# Altium project Node_PCB.PrjPcb
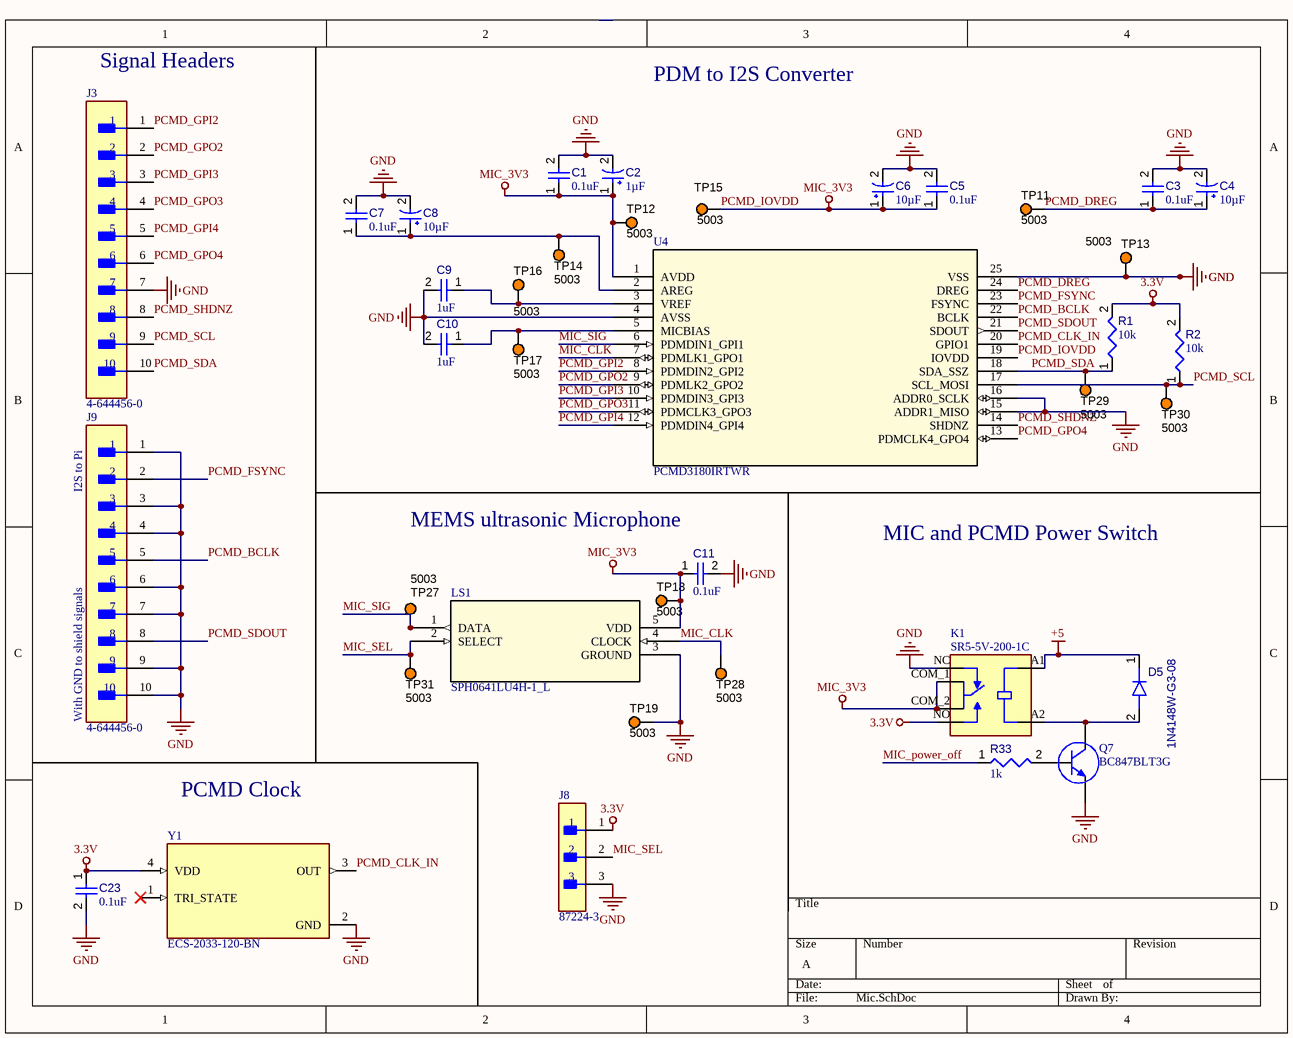
[diagram p0: Mic.SchDoc]
4 sheets, 164 parts. Net scope: global (net labels, ports and power ports of the same name join across sheets).
Board file: Node_Layout.PcbDoc
Sheets:
  Mic.SchDoc
  LoRa.SchDoc
  ATMEGA.SchDoc
  Power.SchDoc

## Sheet Mic.SchDoc
size A; SheetNumber: 1; SheetTotal: 4

### Parts
C1  value 0.1uF  [CAPC1608X90X40NL10T20]  (hidden comment: Capacitor 100 nF +/-10% 50 V 0603)
C2  value 1µF  [CAPPR55-200-1100X500X1200]  (hidden comment: ECA-1HHG010)
C3  value 0.1uF  [CAPC1608X90X40NL10T20]  (hidden comment: Capacitor 100 nF +/-10% 50 V 0603)
C4  value 10µF  [CAPPR55-200-1100X500X1200]  (hidden comment: ECA-1HHG010)
C5  value 0.1uF  [CAPC1608X90X40NL10T20]  (hidden comment: Capacitor 100 nF +/-10% 50 V 0603)
C6  value 10µF  [CAPPR55-200-1100X500X1200]  (hidden comment: ECA-1HHG010)
C7  value 0.1uF  [CAPC1608X90X40NL10T20]  (hidden comment: Capacitor 100 nF +/-10% 50 V 0603)
C8  value 10µF  [CAPPR55-200-1100X500X1200]  (hidden comment: ECA-1HHG010)
C9  value 1uF  [CAPC1608X90X40NL10T20]  (hidden comment: Capacitor 100 nF +/-10% 50 V 0603)
C10  value 1uF  [CAPC1608X90X40NL10T20]  (hidden comment: Capacitor 100 nF +/-10% 50 V 0603)
C11  value 0.1uF  [CAPC1608X90X40NL10T20]  (hidden comment: Capacitor 100 nF +/-10% 50 V 0603)
C23  value 0.1uF  [CAPC1608X90X40NL10T20]  (hidden comment: Capacitor 100 nF +/-10% 50 V 0603)
D5  1N4148W-G3-08  [FP-S8-V-3910_01-001-IPC_B]
J3  4-644456-0  [FP-4-644456-0-MFG]
J8  87224-3  [FP-87224-3-MFG]
J9  4-644456-0  [FP-4-644456-0-MFG]
K1  SR5-5V-200-1C  [RELAY_SR5-5V-200-1C]
LS1  SPH0641LU4H-1_L  [SPH0655LM4H-1_KNO_L]
Q7  BC847BLT3G  [ONSC-SOT-23-3-318-08_V]
R1  value 10k  [RESC0603(1608)_L]  (hidden comment: Resistor 120R +/-5 % 0603 0.1 W)
R2  value 10k  [RESC0603(1608)_L]  (hidden comment: Resistor 120R +/-5 % 0603 0.1 W)
R33  value 1k  [RESC0603(1608)_L]  (hidden comment: Resistor 120R +/-5 % 0603 0.1 W)
TP11  5003  [KSTN-5003]
TP12  5003  [KSTN-5003]
TP13  5003  [KSTN-5003]
TP14  5003  [KSTN-5003]
TP15  5003  [KSTN-5003]
TP16  5003  [KSTN-5003]
TP17  5003  [KSTN-5003]
TP18  5003  [KSTN-5003]
TP19  5003  [KSTN-5003]
TP27  5003  [KSTN-5003]
TP28  5003  [KSTN-5003]
TP29  5003  [KSTN-5003]
TP30  5003  [KSTN-5003]
TP31  5003  [KSTN-5003]
U4  PCMD3180IRTWR  [QFN_0IRTWR_TEX]
Y1  ECS-2033-120-BN  [OSC_ECS-2033-120-BN]

### Nets
3.3V: C23.1 J8.1 K1.NO R1.2 R2.2 Y1.4(VDD)
+5: D5.1(K) K1.A1(COIL1)
GND: C1.2 C2.2 C3.2 C4.2 C5.2 C6.2 C7.2 C8.2 C9.2 C10.2 C11.2 C23.2 J3.7 J8.3 J9.1 J9.3 J9.4 J9.6 J9.7 J9.9 J9.10 K1.NC LS1.3(GROUND) Q7.1(E) TP13.1 TP19.1 U4.4(AVSS) U4.15(ADDR1_MISO) U4.16(ADDR0_SCLK) U4.25(VSS) Y1.2(GND)  [project net Batt-]
PCMD_IOVDD: C1.1 C2.1 C5.1 C6.1 C11.1 K1.COM_1(COM1) K1.COM_2(COM2) LS1.5(VDD) TP12.1 TP15.1 TP18.1 U4.1(AVDD) U4.19(IOVDD)  [also labelled MIC_3V3]
MIC_CLK: LS1.4(CLOCK) TP28.1 U4.7(PDMLK1_GPO1)
MIC_power_off: R33.1
MIC_SEL: J8.2 LS1.2(SELECT) TP31.1
MIC_SIG: LS1.1(DATA) TP27.1 U4.6(PDMDIN1_GPI1)
PCMD_BCLK: J9.5 U4.22(BCLK)
PCMD_CLK_IN: U4.20(GPIO1) Y1.3(OUT)
PCMD_DREG: C3.1 C4.1 TP11.1 U4.24(DREG)
PCMD_FSYNC: J9.2 U4.23(FSYNC)
PCMD_GPI2: J3.1 U4.8(PDMDIN2_GPI2)
PCMD_GPI3: J3.3 U4.10(PDMDIN3_GPI3)
PCMD_GPI4: J3.5 U4.12(PDMDIN4_GPI4)
PCMD_GPO2: J3.2 U4.9(PDMLK2_GPO2)
PCMD_GPO3: J3.4 U4.11(PDMCLK3_GPO3)
PCMD_GPO4: J3.6 U4.13(PDMCLK4_GPO4)
PCMD_SCL: J3.9 R2.1 TP30.1 U4.17(SCL_MOSI)
PCMD_SDA: J3.10 R1.1 TP29.1 U4.18(SDA_SSZ)
PCMD_SDOUT: J9.8 U4.21(SDOUT)
PCMD_SHDNZ: J3.8 U4.14(SHDNZ)
NetC7_1: C7.1 C8.1 TP14.1 U4.2(AREG)
NetC9_1: C9.1 TP16.1 U4.3(VREF)
NetC10_1: C10.1 TP17.1 U4.5(MICBIAS)
NetD5_2: D5.2(A) K1.A2(COIL2) Q7.3(C)
NetQ7_2: Q7.2(B) R33.2

Not connected (* = marked no-connect by the designer): Y1 1(TRI_STATE)*

### Notes on the sheet
- Signal Headers
- PDM to I2S Converter
- (near J9) I2S to Pi
- (near C11) MEMS ultrasonic Microphone
- MIC and PCMD Power Switch
- (near J9) With GND to shield signals
- PCMD Clock

### Library data of the parts
C1 C3 C5 C7 C9-C11 C23 = CMP-001-00017-6: Chip Capacitor, 100 nF, +/- 10%, 50 V, 0603 (1608 Metric); Voltage Rating: 50V; Capacitor Type: Ceramic; Tolerance: 10%; Mounting Technology: SM; Max Operating Temperature: 125°C; RoHS Compliant: True; Pins: 2; Case/Package: 0603; Min Operating Temperature: -55°C
C2 C4 C6 C8 = CMP-001-00024-7: Aluminum Electrolytic Capacitor, 1 uF, +/- 20%, 50 V, -55 to 105 degC, 2-Pin THD, RoHS, Bulk; Manufacturer: Panasonic; Voltage Rating: 50V; Ripple Current: 10mA; Packaging: Bulk; Package Quantity: 200; Tolerance: 20%; Min Operating Temperature: -55°C; Diameter: 5mm; Capacitor Type: Electrolytic; Datasheet Version: Mar-05; Ripple Current (AC): 10mA; Manufacturer URL: http://www.panasonic.com/; Case/Package: Radial; Mounting Technology: TH; Pins: 2; Package Reference: CAPPR55-200-1100X500X1200; Package Description: 2-Pin Radial Lead, Dia 5 mm, Height 12 mm; RoHS Compliant: True; Max Operating Temperature: 105°C; Lead Pitch: 2mm; Datasheet URL: https://datasheet.ciiva.com/7275/94060-7275472.pdf
D5 = CMP-004-00034-1: Rectifier Diode, 1 Phase, 1 Element, 0.15A, 100V V(RRM), Silicon
J3 J9 = CMP-002-00072-1: Board Connector, 10 Contact(s), 1 Row(s), Male, Straight, 0.1 inch Pitch, Solder Terminal, Natural Insulator, Plug; Min Operating Temperature: -55°C; RoHS Compliant: Yes; Mounting Technology: Board; Max Operating Temperature: 105°C; Connector Type: BOARD CONNECTOR
J8 = CMP-002-00078-1: Board Connector, 3 Contact(s), 1 Row(s), Male, Straight, 0.1 inch Pitch, Solder Terminal, Black Insulator, Receptacle; Mounting Technology: Board; Max Operating Temperature: 105°C; RoHS Compliant: Yes; Connector Type: BOARD CONNECTOR; Min Operating Temperature: -65°C
K1 = CMP-029-000000-1: 15.6 x 10.6 x 11.8 mm, 5 V, 1 A, SPDT (1 Form C), Through Hole, Signal Relay; MF: CUI Devices; Pin Count: 6; Component Type: Standard; MP: SR5-5V-200-1C; Design Item ID: SR5-5V-200-1C; Package: None; CUI_purchase_URL: https://www.cuidevices.com/product/relays/signal-relays/sr5-5v-200-1c?utm_source=snapeda.com&utm_medium=referral&utm_campaign=snapedaBOM; Source: SR5-5V-200-1C.SchLib; SnapEDA_Link: https://www.snapeda.com/parts/SR5-5V-200-1C/CUI+Devices/view-part/?ref=snap; Value: *; Check_prices: https://www.snapeda.com/parts/SR5-5V-200-1C/CUI+Devices/view-part/?ref=eda
LS1 = CMP-00027-00004-1: No Description Available; Mfr_Name: Knowles; Source: SPH0641LU4H-1_L.SchLib; Copyright: Copyright (C) 2023 Ultra Librarian. All rights reserved.; Manufacturer_Part_Number: SPH0641LU4H-1; Design Item ID: SPH0641LU4H-1_L; Type: DEV; RefDes: RefDes
Q7 = CMP-013-00036-1: Small Signal Bipolar Transistor, 0.1A I(C), 45V V(BR)CEO, 1-Element, NPN, Silicon, TO-236; Frequency: 100MHz; RoHS Compliant: Yes; Max Operating Temperature: 150°C; Pins: 3
R1 R2 R33 = CMP-009-00176-3: Chip Resistor, 120 Ohms, +/-5 %, 0.1 W, -55 to 155 degC, 0603; Power: 100mW; Tolerance: 5%; Max Operating Temperature: 155°C; Pins: 2; Case/Package: 0603; Min Operating Temperature: -55°C
TP11-TP19 TP27-TP31 = CMP-002-00037-2: Test Point, Orange, Height 4.6 mm, Tail Length 3 mm, 1-Pin THD, RoHS; Manufacturer: Keystone; Colour: Orange; Packaging: Bulk; Package Description: 1-Pin Through Hole Device, Dia 2.54 mm; Pins: 1; Package Reference: 5003; Datasheet Version: Jun-15; Case/Package: 5003; Mounting Technology: TH; Connector Type: TestPoint; Diameter: 2.54mm; Contact Material: Bronze; Datasheet URL: http://keyelco.com/userAssets/file/M65p56.pdf; Manufacturer URL: http://www.keyelco.com/; Package Quantity: 10; Contact Plating: Tin; RoHS Compliant: True
U4 = CMP-011-000000-1: No Description Available; Mfr_Name: Texas Instruments; Source: PCMD3180IRTWR.SchLib; Design Item ID: PCMD3180IRTWR; Manufacturer_Part_Number: PCMD3180IRTWR; RefDes: RefDes; Type: DEV; Copyright: Copyright (C) 2023 Ultra Librarian. All rights reserved.
Y1 = CMP-023-000000-1: 12MHz XO (Standard) CMOS Oscillator 3.3V Enable/Disable 4-SMD, No Lead; MF: ECS Inc.; Source: ECS-2033-120-BN.SchLib; Availability: Good; Package: SMD-4 ECS International; SnapEDA_Link: https://www.snapeda.com/parts/ECS-2033-120-BN/ECS%20Inc./view-part/2724744/?ref=snap; Component Type: Standard; Value: *; Pin Count: 4; Arrow_Electronics-Purchase-URL: https://snapeda.com/shop?store=Arrow+Electronics&id=2724744; Design Item ID: ECS-2033-120-BN; Mouser-Purchase-URL: https://snapeda.com/shop?store=Mouser&id=2724744; Price: None; DigiKey-Purchase-URL: https://snapeda.com/shop?store=DigiKey&id=2724744; MP: ECS-2033-120-BN

## Sheet LoRa.SchDoc
size A; SheetNumber: 2; SheetTotal: 4
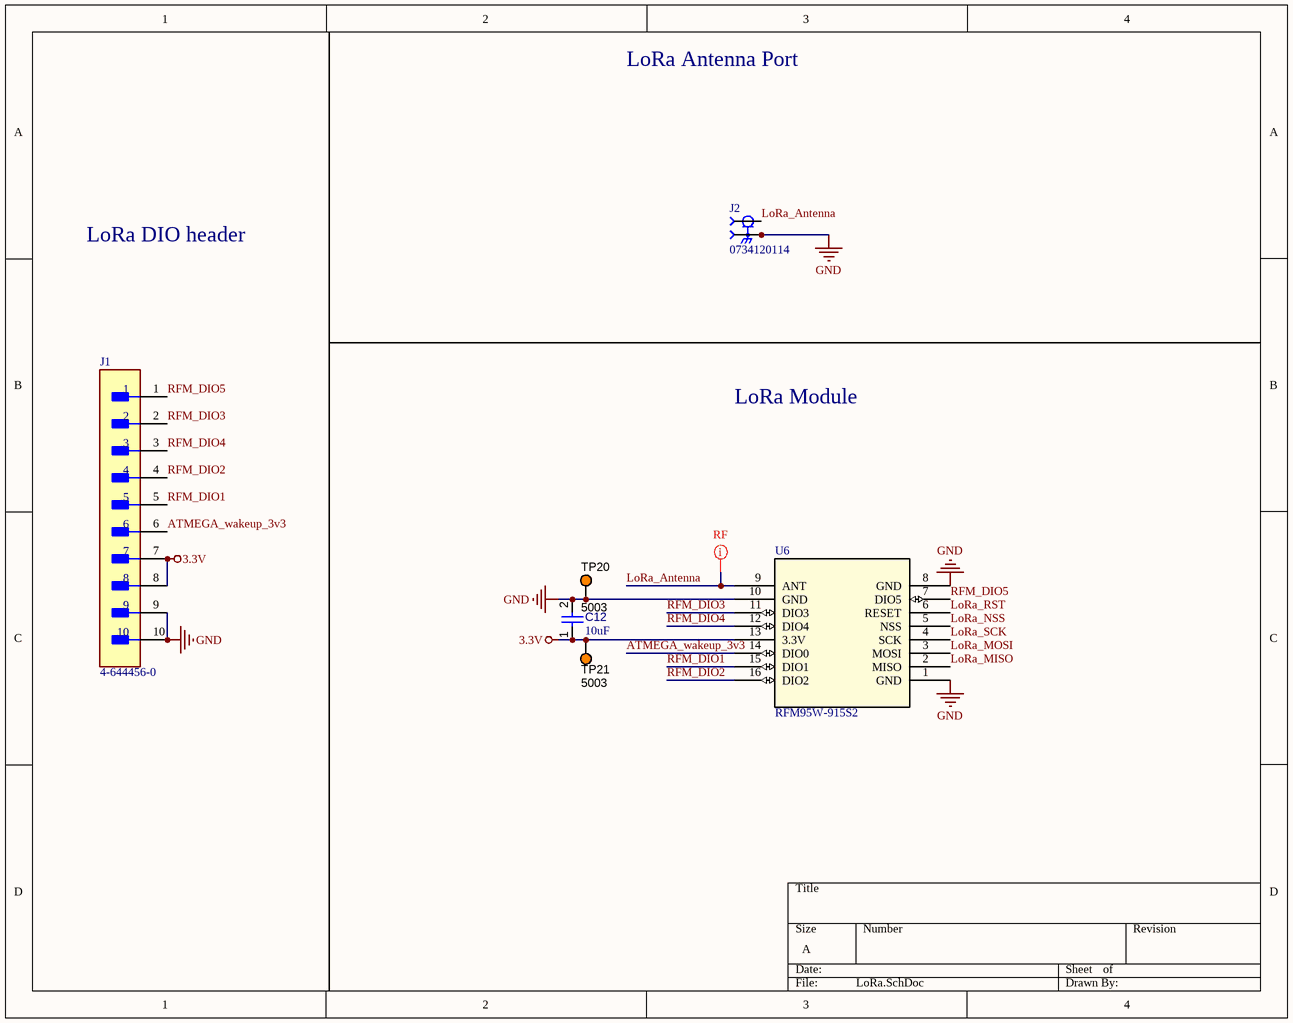
[diagram p1: LoRa.SchDoc]

### Parts
C12  value 10uF  [CAPC1608X90X40NL10T20]  (hidden comment: Capacitor 100 nF +/-10% 50 V 0603)
J1  4-644456-0  [FP-4-644456-0-MFG]
J2  0734120114  [MOLEX_0734120114]
TP20  5003  [KSTN-5003]
TP21  5003  [KSTN-5003]
U6  RFM95W-915S2  [IC16_RFM95W-915S2_RFS]

### Nets
3.3V: C12.1 J1.7 J1.8 TP21.1 U6.13(3.3V)
GND: C12.2 J1.9 J1.10 J2.2(GND) J2.3(GND) J2.4(GND) TP20.1 U6.1(GND) U6.8(GND) U6.10(GND)  [project net Batt-]
ATMEGA_wakeup_3v3: J1.6 U6.14(DIO0)
LoRa_Antenna: J2.1(SIG) U6.9(ANT)
LoRa_MISO: U6.2(MISO)
LoRa_MOSI: U6.3(MOSI)
LoRa_NSS: U6.5(NSS)
LoRa_RST: U6.6(RESET)
LoRa_SCK: U6.4(SCK)
RFM_DIO1: J1.5 U6.15(DIO1)
RFM_DIO2: J1.4 U6.16(DIO2)
RFM_DIO3: J1.2 U6.11(DIO3)
RFM_DIO4: J1.3 U6.12(DIO4)
RFM_DIO5: J1.1 U6.7(DIO5)

### Layout directives
net class RF: LoRa_Antenna

### Notes on the sheet
- LoRa Antenna Port
- LoRa DIO header
- LoRa Module

### Library data of the parts
C12 = CMP-001-00017-6: as C1 on sheet Mic; Tolerance: 10%; Mounting Technology: SM; Max Operating Temperature: 125°C; RoHS Compliant: True; Pins: 2; Case/Package: 0603; Min Operating Temperature: -55°C
J1 = CMP-002-00072-1: as J3 on sheet Mic; Min Operating Temperature: -55°C; RoHS Compliant: Yes; Mounting Technology: Board; Max Operating Temperature: 105°C; Connector Type: BOARD CONNECTOR
J2 = CMP-003-000000-1: U.FL (UMCC) Connector Receptacle, Male Pin 50Ohm Surface Mount Solder; MF: Molex; Value: *; Price: None; Source: 0734120114.SchLib; Component Type: Standard; Pin Count: 4; SnapEDA_Link: https://www.snapeda.com/parts/0734120114/Molex/view-part/557843/?ref=snap; Package: None; Availability: Unavailable; MP: 0734120114; Design Item ID: 0734120114
TP20 TP21 = CMP-002-00037-2: as TP11 on sheet Mic; Colour: Orange; Packaging: Bulk; Package Description: 1-Pin Through Hole Device, Dia 2.54 mm; Pins: 1; Package Reference: 5003; Datasheet Version: Jun-15; Case/Package: 5003; Mounting Technology: TH; Connector Type: TestPoint; Diameter: 2.54mm; Contact Material: Bronze; Datasheet URL: http://keyelco.com/userAssets/file/M65p56.pdf; Manufacturer URL: http://www.keyelco.com/; Package Quantity: 10; Contact Plating: Tin; RoHS Compliant: True
U6 = CMP-00025-00004-1: No Description Available; Mfr_Name: RF Solutions; Copyright: Copyright (C) 2023 Ultra Librarian. All rights reserved.; RefDes: RefDes; Source: RFM95W-915S2.SchLib; Type: DEV; Manufacturer_Part_Number: RFM95W-915S2; Design Item ID: RFM95W-915S2

## Sheet ATMEGA.SchDoc
size A; SheetNumber: 3; SheetTotal: 4
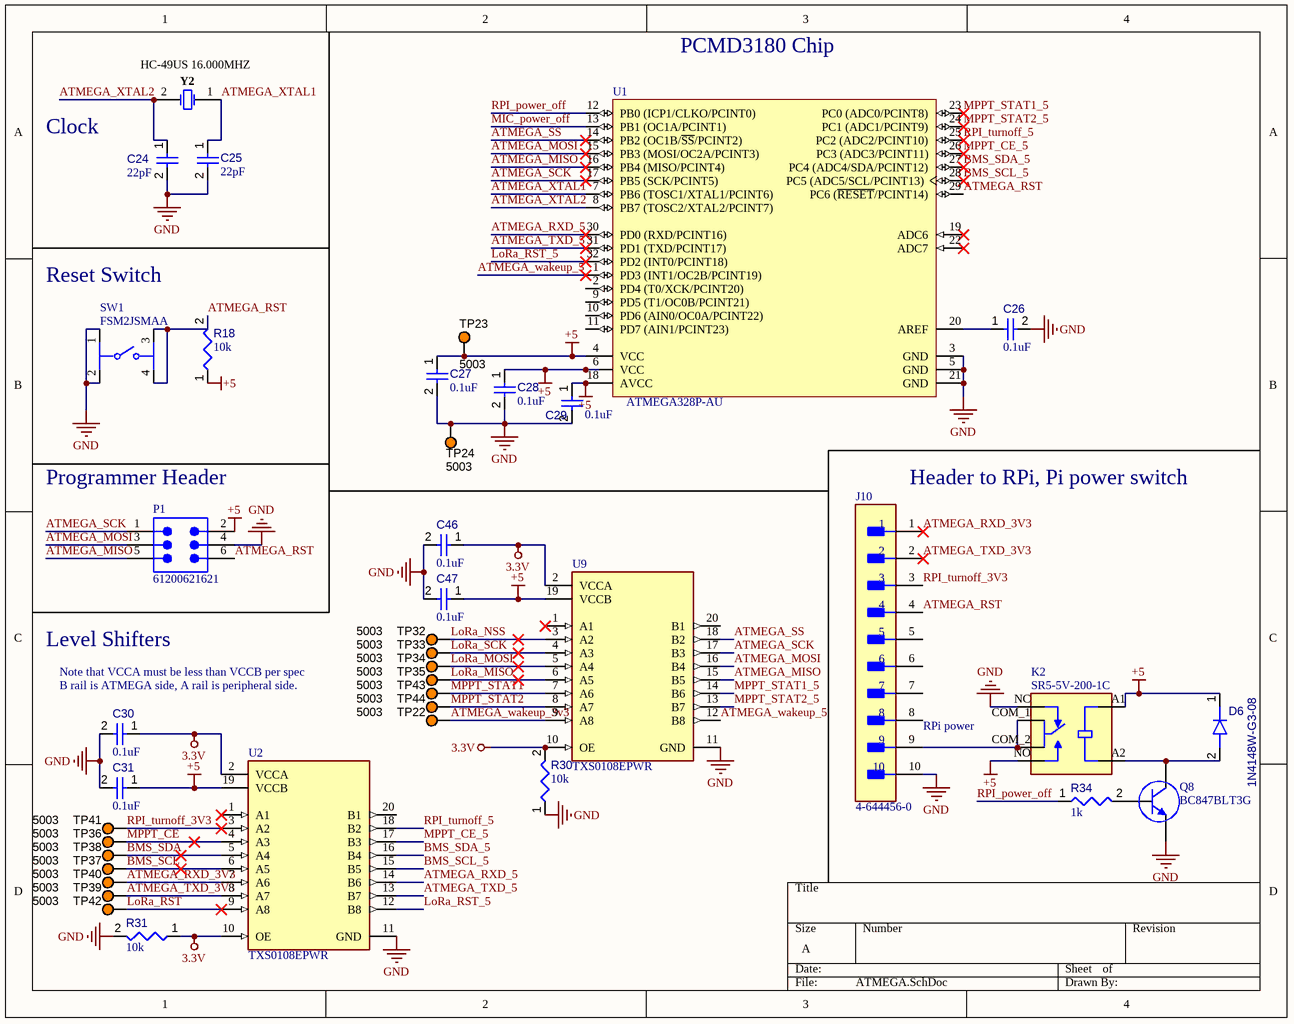
[diagram p2: ATMEGA.SchDoc]

### Parts
C24  value 22pF  [FP-C0603C-CF-IPC_B]  (hidden comment: C0603C220J5GACTU)
C25  value 22pF  [FP-C0603C-CF-IPC_B]  (hidden comment: C0603C220J5GACTU)
C26  value 0.1uF  [CAPC1608X90X40NL10T20]  (hidden comment: Capacitor 100 nF +/-10% 50 V 0603)
C27  value 0.1uF  [CAPC1608X90X40NL10T20]  (hidden comment: Capacitor 100 nF +/-10% 50 V 0603)
C28  value 0.1uF  [CAPC1608X90X40NL10T20]  (hidden comment: Capacitor 100 nF +/-10% 50 V 0603)
C29  value 0.1uF  [CAPC1608X90X40NL10T20]  (hidden comment: Capacitor 100 nF +/-10% 50 V 0603)
C30  value 0.1uF  [CAPC1608X90X40NL10T20]  (hidden comment: Capacitor 100 nF +/-10% 50 V 0603)
C31  value 0.1uF  [CAPC1608X90X40NL10T20]  (hidden comment: Capacitor 100 nF +/-10% 50 V 0603)
C46  value 0.1uF  [CAPC1608X90X40NL10T20]  (hidden comment: Capacitor 100 nF +/-10% 50 V 0603)
C47  value 0.1uF  [CAPC1608X90X40NL10T20]  (hidden comment: Capacitor 100 nF +/-10% 50 V 0603)
D6  1N4148W-G3-08  [FP-S8-V-3910_01-001-IPC_B]
J10  4-644456-0  [FP-4-644456-0-MFG]
K2  SR5-5V-200-1C  [RELAY_SR5-5V-200-1C]
P1  61200621621  [61200621621]
Q8  BC847BLT3G  [ONSC-SOT-23-3-318-08_V]
R18  value 10k  [RESC0603(1608)_L]  (hidden comment: Resistor 120R +/-5 % 0603 0.1 W)
R30  value 10k  [RESC0603(1608)_L]  (hidden comment: Resistor 120R +/-5 % 0603 0.1 W)
R31  value 10k  [RESC0603(1608)_L]  (hidden comment: Resistor 120R +/-5 % 0603 0.1 W)
R34  value 1k  [RESC0603(1608)_L]  (hidden comment: Resistor 120R +/-5 % 0603 0.1 W)
SW1  FSM2JSMAA  [FP-FSM2JSMAA-MFG]
TP22  5003  [KSTN-5003]
TP23  5003  [KSTN-5003]
TP24  5003  [KSTN-5003]
TP32  5003  [KSTN-5003]
TP33  5003  [KSTN-5003]
TP34  5003  [KSTN-5003]
TP35  5003  [KSTN-5003]
TP36  5003  [KSTN-5003]
TP37  5003  [KSTN-5003]
TP38  5003  [KSTN-5003]
TP39  5003  [KSTN-5003]
TP40  5003  [KSTN-5003]
TP41  5003  [KSTN-5003]
TP42  5003  [KSTN-5003]
TP43  5003  [KSTN-5003]
TP44  5003  [KSTN-5003]
U1  ATMEGA328P-AU  [ATML-32A_M]
U2  TXS0108EPWR  [FP-PW0020A-IPC_A]
U9  TXS0108EPWR  [FP-PW0020A-IPC_A]
Y2  HC-49US 16.000MHZ  [JPY-HC-49US]

### Nets
3.3V: C30.1 C46.1 R30.2 R31.1 U2.2(VCCA) U2.10(OE) U9.2(VCCA) U9.10(OE)
+5: C27.1 C28.1 C29.1 C31.1 C47.1 D6.1(K) K2.A1(COIL1) K2.NO P1.2 R18.1 TP23.1 U1.4(VCC) U1.6(VCC) U1.18(AVCC) U2.19(VCCB) U9.19(VCCB)
GND: C24.2 C25.2 C26.2 C27.2 C28.2 C29.2 C30.2 C31.2 C46.2 C47.2 J10.10 K2.NC P1.4 Q8.1(E) R30.1 R31.2 SW1.1 SW1.2 TP24.1 U1.3(GND) U1.5(GND) U1.21(GND) U2.11(GND) U9.11(GND)  [project net Batt-]
ATMEGA_MISO: P1.5 U1.16(PB4_(MISO/PCINT4)) U9.15(B5)
ATMEGA_MOSI: P1.3 U1.15(PB3_(MOSI/OC2A/PCINT3)) U9.16(B4)
ATMEGA_RST: J10.4 P1.6 R18.2 SW1.3 SW1.4 U1.29(PC6_(~{RESET}/PCINT14))
ATMEGA_RXD_3V3: J10.1 TP40.1 U2.7(A6)
ATMEGA_RXD_5: U1.30(PD0_(RXD/PCINT16)) U2.14(B6)
ATMEGA_SCK: P1.1 U1.17(PB5_(SCK/PCINT5)) U9.17(B3)
ATMEGA_SS: U1.14(PB2_(OC1B/~{SS}/PCINT2)) U9.18(B2)
ATMEGA_TXD_3V3: J10.2 TP39.1 U2.8(A7)
ATMEGA_TXD_5: U1.31(PD1_(TXD/PCINT17)) U2.13(B7)
ATMEGA_wakeup_3v3: TP22.1 U9.9(A8)
ATMEGA_wakeup_5: U1.1(PD3_(INT1/OC2B/PCINT19)) U9.12(B8)
ATMEGA_XTAL1: C25.1 U1.7(PB6_(TOSC1/XTAL1/PCINT6)) Y2.1
ATMEGA_XTAL2: C24.1 U1.8(PB7_(TOSC2/XTAL2/PCINT7)) Y2.2
BMS_SCL: TP37.1 U2.6(A5)
BMS_SCL_5: U1.28(PC5_(ADC5/SCL/PCINT13)) U2.15(B5)
BMS_SDA: TP38.1 U2.5(A4)
BMS_SDA_5: U1.27(PC4_(ADC4/SDA/PCINT12)) U2.16(B4)
LoRa_MISO: TP35.1 U9.6(A5)
LoRa_MOSI: TP34.1 U9.5(A4)
LoRa_NSS: TP32.1 U9.3(A2)
LoRa_RST: TP42.1 U2.9(A8)
LoRa_RST_5: U1.32(PD2_(INT0/PCINT18)) U2.12(B8)
LoRa_SCK: TP33.1 U9.4(A3)
MIC_power_off: U1.13(PB1_(OC1A/PCINT1))
MPPT_CE: TP36.1 U2.4(A3)
MPPT_CE_5: U1.26(PC3_(ADC3/PCINT11)) U2.17(B3)
MPPT_STAT1: TP43.1 U9.7(A6)
MPPT_STAT1_5: U1.23(PC0_(ADC0/PCINT8)) U9.14(B6)
MPPT_STAT2: TP44.1 U9.8(A7)
MPPT_STAT2_5: U1.24(PC1_(ADC1/PCINT9)) U9.13(B7)
RPI_power_off: R34.1 U1.12(PB0_(ICP1/CLKO/PCINT0))
RPI_turnoff_3V3: J10.3 TP41.1 U2.3(A2)
RPI_turnoff_5: U1.25(PC2_(ADC2/PCINT10)) U2.18(B2)
NetC26_1: C26.1 U1.20(AREF)
NetD6_2: D6.2(A) K2.A2(COIL2) Q8.3(C)
NetJ10_9: J10.9 K2.COM_1(COM1) K2.COM_2(COM2)
NetQ8_2: Q8.2(B) R34.2

Not connected (* = marked no-connect by the designer): J10 5 6 7 8; U1 2(PD4_(T0/XCK/PCINT20)) 9(PD5_(T1/OC0B/PCINT21)) 10(PD6_(AIN0/OC0A/PCINT22)) 11(PD7_(AIN1/PCINT23)) 19(ADC6)* 22(ADC7)*; U2 1(A1)* 20(B1); U9 1(A1)* 20(B1)

### Notes on the sheet
- PCMD3180 Chip
- Clock
- Reset Switch
- (near P1) Programmer Header
- (near J10) Header to RPi, Pi power switch
- Level Shifters
- Note that VCCA must be less than VCCB per spec
- (near C30) B rail is ATMEGA side, A rail is peripheral side.
- (near J10) RPi power

### Library data of the parts
C24 C25 = CMP-001-00083-1: Ceramic Capacitor, Multilayer, Ceramic, 50V, 5% +Tol, 5% -Tol, C0G, 30ppm/Cel TC, 0.000022uF, Surface Mount, 0603; Mounting Technology: Surface Mount; Pins: 2; Max Operating Temperature: 125°C; Capacitor Type: Ceramic; RoHS Compliant: Yes; Min Operating Temperature: -55°C; Case/Package: 0603
C26-C31 C46 C47 = CMP-001-00017-6: as C1 on sheet Mic; Tolerance: 10%; Mounting Technology: SM; Max Operating Temperature: 125°C; RoHS Compliant: True; Pins: 2; Case/Package: 0603; Min Operating Temperature: -55°C
D6 = CMP-004-00034-1: as D5 on sheet Mic
J10 = CMP-002-00072-1: as J3 on sheet Mic; Min Operating Temperature: -55°C; RoHS Compliant: Yes; Mounting Technology: Board; Max Operating Temperature: 105°C; Connector Type: BOARD CONNECTOR
K2 = CMP-029-000000-1: as K1 on sheet Mic; Pin Count: 6; Component Type: Standard; MP: SR5-5V-200-1C; Design Item ID: SR5-5V-200-1C; Package: None; CUI_purchase_URL: https://www.cuidevices.com/product/relays/signal-relays/sr5-5v-200-1c?utm_source=snapeda.com&utm_medium=referral&utm_campaign=snapedaBOM; Source: SR5-5V-200-1C.SchLib; SnapEDA_Link: https://www.snapeda.com/parts/SR5-5V-200-1C/CUI+Devices/view-part/?ref=snap; Value: *; Check_prices: https://www.snapeda.com/parts/SR5-5V-200-1C/CUI+Devices/view-part/?ref=eda
P1 = CMP-002-00075-1: Board Connector, 6 Contact(s), 2 Row(s), Male, Straight, Solder Terminal; RoHS Compliant: Yes; Connector Type: BOARD CONNECTOR; Mounting Technology: Board
Q8 = CMP-013-00036-1: as Q7 on sheet Mic; RoHS Compliant: Yes; Max Operating Temperature: 150°C; Pins: 3
R18 R30 R31 R34 = CMP-009-00176-3: as R1 on sheet Mic; Max Operating Temperature: 155°C; Pins: 2; Case/Package: 0603; Min Operating Temperature: -55°C
SW1 = CMP-011-00013-1: Keypad Switch, 1 Switches, SPST, Momentary-tactile, 0.05A, 24VDC, 3.04N, Solder Terminal, Surface Mount-straight; RoHS Compliant: Yes; Max Operating Temperature: 85°C; Mounting Technology: Surface Mount; Min Operating Temperature: -20°C
TP22-TP24 TP32-TP44 = CMP-002-00037-2: as TP11 on sheet Mic; Colour: Orange; Packaging: Bulk; Package Description: 1-Pin Through Hole Device, Dia 2.54 mm; Pins: 1; Package Reference: 5003; Datasheet Version: Jun-15; Case/Package: 5003; Mounting Technology: TH; Connector Type: TestPoint; Diameter: 2.54mm; Contact Material: Bronze; Datasheet URL: http://keyelco.com/userAssets/file/M65p56.pdf; Manufacturer URL: http://www.keyelco.com/; Package Quantity: 10; Contact Plating: Tin; RoHS Compliant: True
U1 = CMP-020-00003-3: 8-Bit Microcontroller with 32 KBytes In-System Programmable Flash, 23 I/Os, -40 to 85 degC, 32-Pin TQFP (32A), RoHS, Tray; Manufacturer: Atmel; PWM Channels: 6; Frequency: 20MHz; RAM Size: 2KB; ADC Channels: 8; Max Supply Voltage: 5.5V; Density: 32KB; USB Channels: 0; I/Os: 23; Min Supply Voltage: 1.8V; Interface: USART; Package Reference: 32A; Package Description: 32-Pin Thin Profile Plastic Quad Flat Package, Body 7 x 7 mm, Pitch 0.8 mm; Max Operating Temperature: 85°C; Mounting Technology: SM; Datasheet URL: http://www.atmel.com/images/Atmel-8271-8-bit-AVR-Microcontroller-ATmega48A-48PA-88A-88PA-168A-168PA-328-328P_datasheet_Complete.pdf; Pins: 32; Packaging: Tray; RoHS Compliant: True; Max Clock Frequency: 20MHz; Ethernet Channels: 0; Clock Frequency: 20MHz; Case/Package: TQFP; Manufacturer URL: http://www.atmel.com/; Datasheet Version: Rev. 8271J, 11/2015; Package Quantity: 250; Min Operating Temperature: -40°C
U2 U9 = CMP-019-00054-1: Interface Circuit, PDSO20; Max Supply Voltage: 3.6V; Min Supply Voltage: 1.2V; Min Operating Temperature: -40°C; Case/Package: TSSOP; Max Operating Temperature: 85°C; RoHS Compliant: Yes; Pins: 20
Y2 = CMP-003-00005-2: Crystal, 16 MHz, +/- 30 ppm, 18 pF, -20 to 70 degC, 2-Pin THD; Manufacturer: Jing peng yuan; Frequency: 16MHz; Package Reference: HC-49US; Case/Package: HC-49US; RoHS Compliant: Unknown; Mounting Technology: TH; Package Description: 2-Pin Throug Hole Device, Body 11.05 x 4.65 mm, Pitch 4.9 mm; Datasheet URL: https://statics3.seeedstudio.com/images/opl/datasheet/306010014.pdf; Datasheet Version: May-15

## Sheet Power.SchDoc
size 431 x 279 mm; SheetNumber: 4; SheetTotal: 4
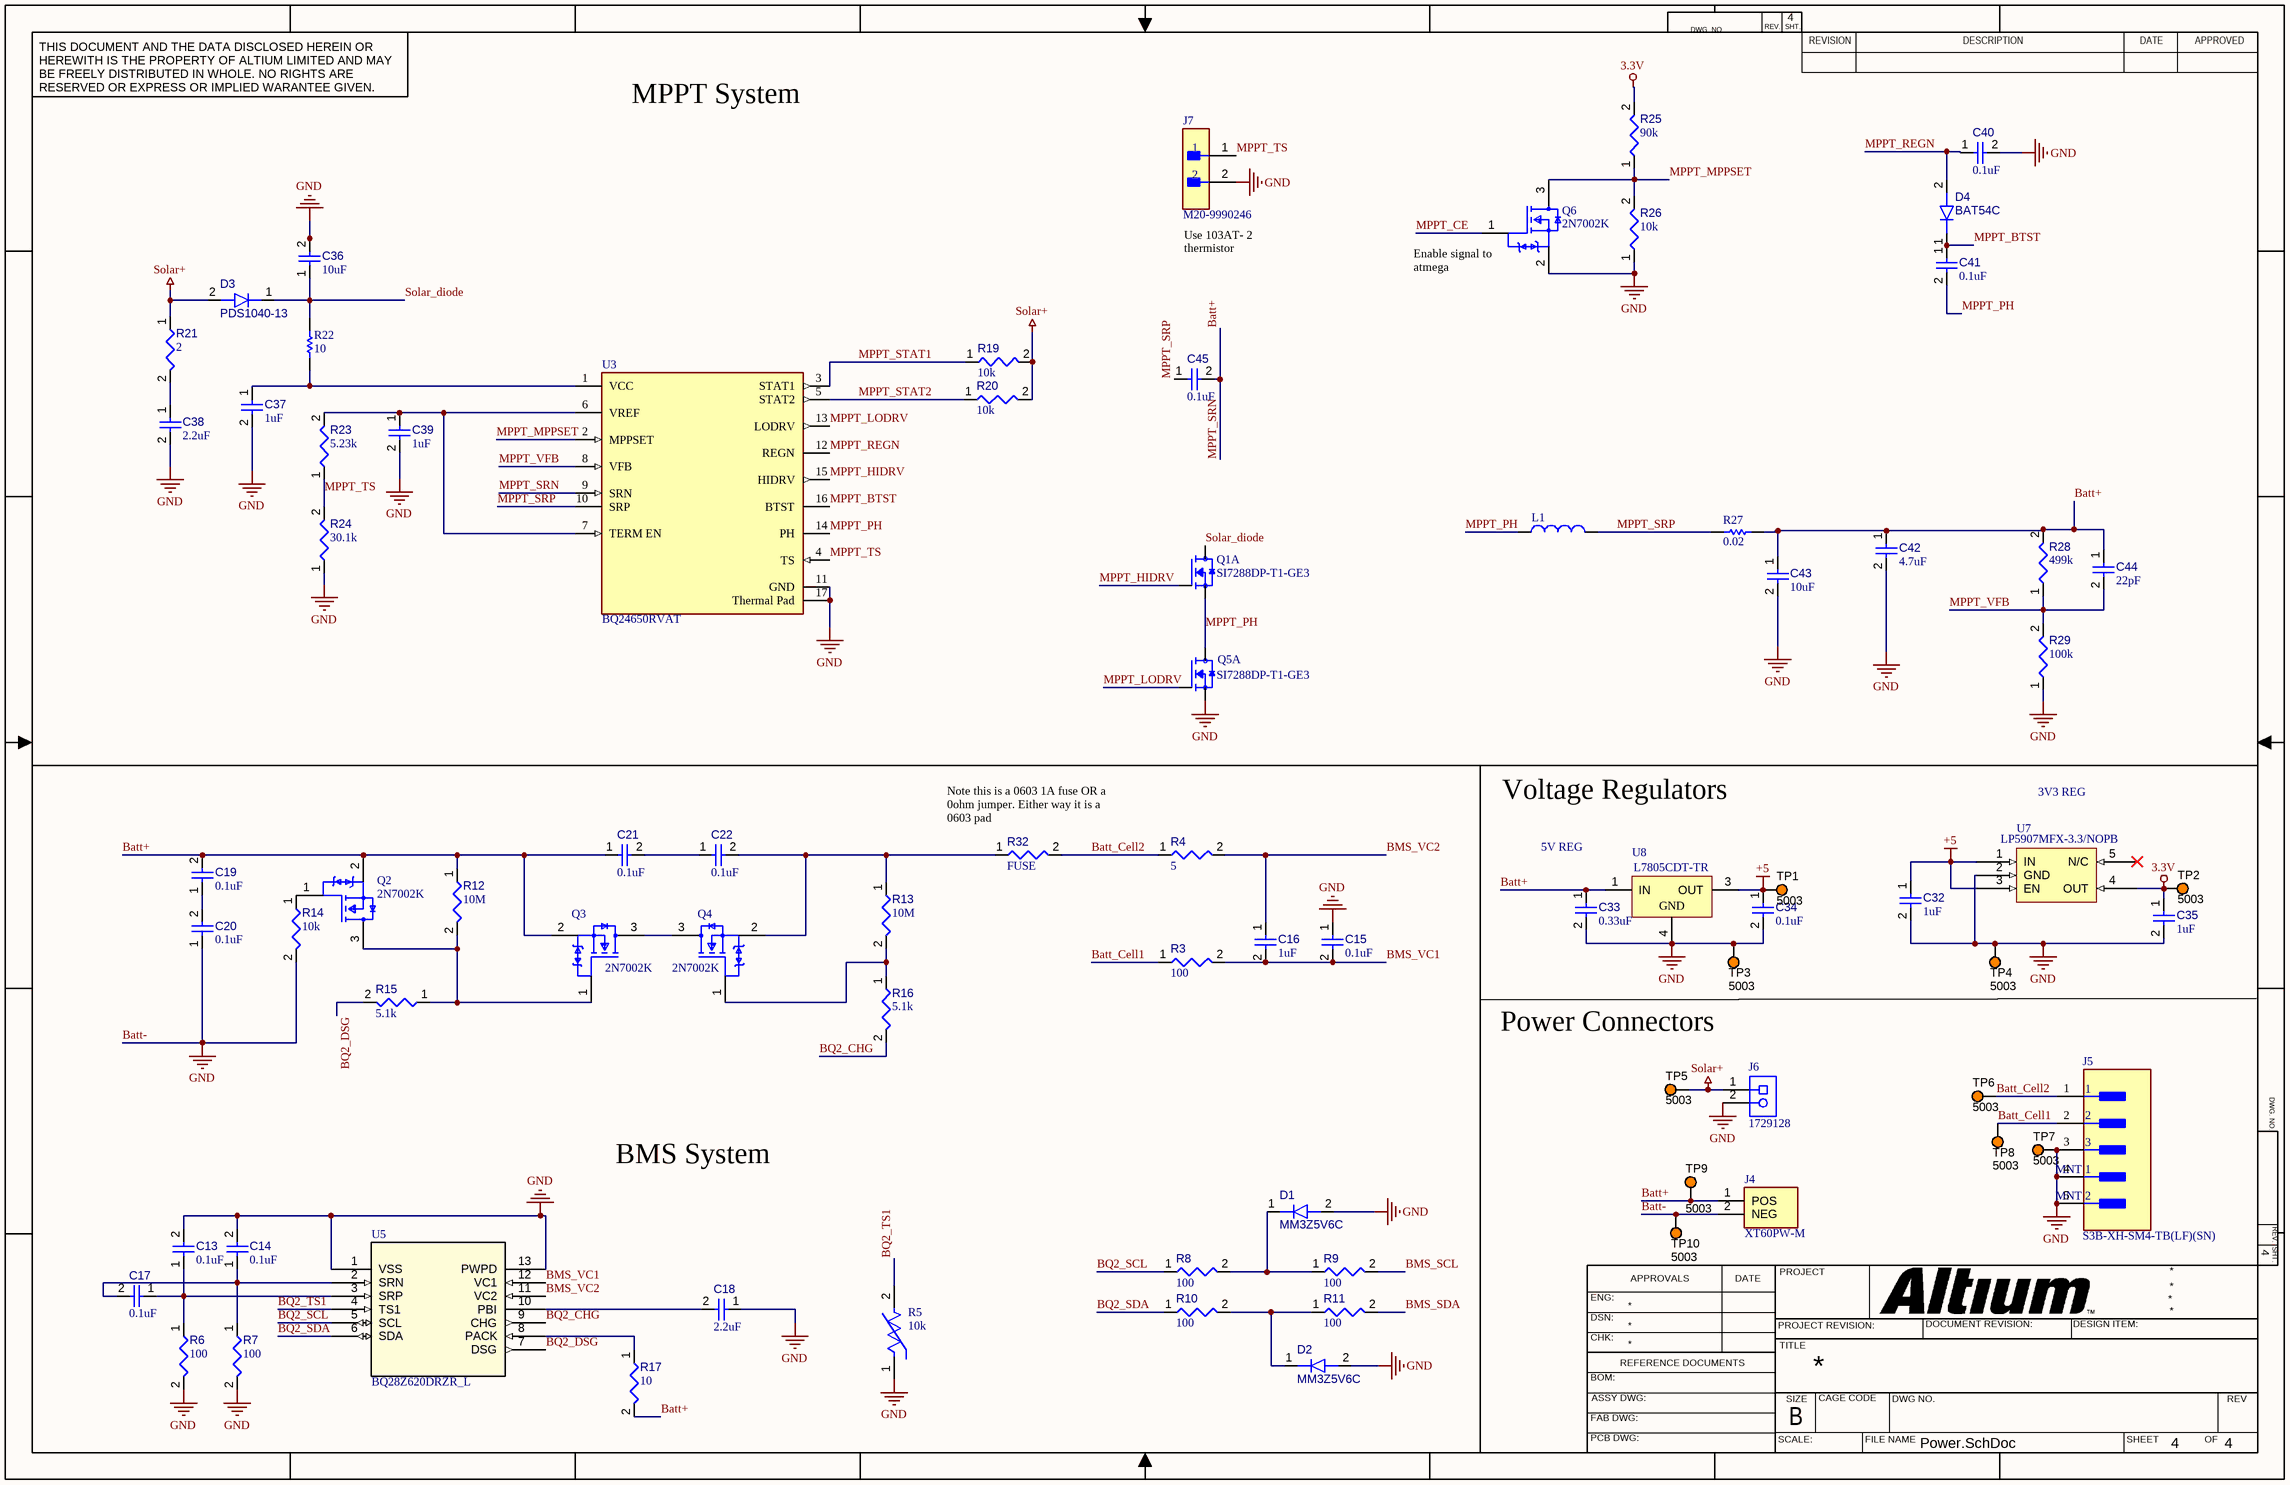
[diagram p3: Power.SchDoc]

### Parts
C13  value 0.1uF  [CAPC1608X90X40NL10T20]  (hidden comment: Capacitor 100 nF +/-10% 50 V 0603)
C14  value 0.1uF  [CAPC1608X90X40NL10T20]  (hidden comment: Capacitor 100 nF +/-10% 50 V 0603)
C15  value 0.1uF  [CAPC1608X90X40NL10T20]  (hidden comment: Capacitor 100 nF +/-10% 50 V 0603)
C16  value 1uF  [CAPC1608X90X40NL10T20]  (hidden comment: Capacitor 100 nF +/-10% 50 V 0603)
C17  value 0.1uF  [CAPC1608X90X40NL10T20]  (hidden comment: Capacitor 100 nF +/-10% 50 V 0603)
C18  value 2.2uF  [CAPC1608X90X40NL10T20]  (hidden comment: Capacitor 100 nF +/-10% 50 V 0603)
C19  value 0.1uF  [CAPC1608X90X40NL10T20]  (hidden comment: Capacitor 100 nF +/-10% 50 V 0603)
C20  value 0.1uF  [CAPC1608X90X40NL10T20]  (hidden comment: Capacitor 100 nF +/-10% 50 V 0603)
C21  value 0.1uF  [CAPC1608X90X40NL10T20]  (hidden comment: Capacitor 100 nF +/-10% 50 V 0603)
C22  value 0.1uF  [CAPC1608X90X40NL10T20]  (hidden comment: Capacitor 100 nF +/-10% 50 V 0603)
C32  value 1uF  [CAPC1608X90X40NL10T20]  (hidden comment: Capacitor 100 nF +/-10% 50 V 0603)
C33  value 0.33uF  [CAPC1608X90X40NL10T20]  (hidden comment: Capacitor 100 nF +/-10% 50 V 0603)
C34  value 0.1uF  [CAPC1608X90X40NL10T20]  (hidden comment: Capacitor 100 nF +/-10% 50 V 0603)
C35  value 1uF  [CAPC1608X90X40NL10T20]  (hidden comment: Capacitor 100 nF +/-10% 50 V 0603)
C36  value 10uF  [FP-CGA6P-IPC_B]  (hidden comment: CGA6M3X7R2E104K200AE)
C37  value 1uF  [CAPC1608X90X40NL10T20]  (hidden comment: Capacitor 100 nF +/-10% 50 V 0603)
C38  value 2.2uF  [FP-CGA6P-IPC_B]  (hidden comment: CGA6M3X7R2E104K200AE)
C39  value 1uF  [CAPC1608X90X40NL10T20]  (hidden comment: Capacitor 100 nF +/-10% 50 V 0603)
C40  value 0.1uF  [CAPC1608X90X40NL10T20]  (hidden comment: Capacitor 100 nF +/-10% 50 V 0603)
C41  value 0.1uF  [CAPC1608X90X40NL10T20]  (hidden comment: Capacitor 100 nF +/-10% 50 V 0603)
C42  value 4.7uF  [FP-CGA6P-IPC_B]  (hidden comment: CGA6M3X7R2E104K200AE)
C43  value 10uF  [FP-CGA6P-IPC_B]  (hidden comment: CGA6M3X7R2E104K200AE)
C44  value 22pF  [CAPC1608X90X40NL10T20]  (hidden comment: Capacitor 100 nF +/-10% 50 V 0603)
C45  value 0.1uF  [CAPC1608X90X40NL10T20]  (hidden comment: Capacitor 100 nF +/-10% 50 V 0603)
D1  MM3Z5V6C  [FP-SOD-323F-MFG]
D2  MM3Z5V6C  [FP-SOD-323F-MFG]
D3  PDS1040-13  [FP-PowerDI5-MFG]
D4  BAT54C  [NXP-SOT23-3_V]
J4  XT60PW-M  [AMASS_XT60PW-M]
J5  S3B-XH-SM4-TB(LF)(SN)  [FP-S3B-XH-SM4-TB_LF_SN-MFG]
J6  1729128  [PHOE-1729128-2_V]
J7  M20-9990246  [FP-M20-9990246-MFG]
L1  IHLP2525CZER100M01  [VISH-IHLP2525C-01_V]  (value not drawn)
Q1  SI7288DP-T1-GE3  [TRANS_SI7288DP-T1-GE3]  (part A of 2)
Q2  2N7002K  [FP-318-08-IPC_C]
Q3  2N7002K  [FP-318-08-IPC_C]
Q4  2N7002K  [FP-318-08-IPC_C]
Q5  SI7288DP-T1-GE3  [TRANS_SI7288DP-T1-GE3]  (part A of 2)
Q6  2N7002K  [FP-318-08-IPC_C]
R3  value 100  [RESC0603(1608)_L]  (hidden comment: Resistor 120R +/-5 % 0603 0.1 W)
R4  value 5  [RESC0603(1608)_L]  (hidden comment: Resistor 120R +/-5 % 0603 0.1 W)
R5  value 10k  [FP-103AT-2-MFG]  (hidden comment: 103AT-2)
R6  value 100  [RESC0603(1608)_L]  (hidden comment: Resistor 120R +/-5 % 0603 0.1 W)
R7  value 100  [RESC0603(1608)_L]  (hidden comment: Resistor 120R +/-5 % 0603 0.1 W)
R8  value 100  [RESC0603(1608)_L]  (hidden comment: Resistor 120R +/-5 % 0603 0.1 W)
R9  value 100  [RESC0603(1608)_L]  (hidden comment: Resistor 120R +/-5 % 0603 0.1 W)
R10  value 100  [RESC0603(1608)_L]  (hidden comment: Resistor 120R +/-5 % 0603 0.1 W)
R11  value 100  [RESC0603(1608)_L]  (hidden comment: Resistor 120R +/-5 % 0603 0.1 W)
R12  value 10M  [RESC0603(1608)_L]  (hidden comment: Resistor 120R +/-5 % 0603 0.1 W)
R13  value 10M  [RESC0603(1608)_L]  (hidden comment: Resistor 120R +/-5 % 0603 0.1 W)
R14  value 10k  [RESC0603(1608)_L]  (hidden comment: Resistor 120R +/-5 % 0603 0.1 W)
R15  value 5.1k  [RESC0603(1608)_L]  (hidden comment: Resistor 120R +/-5 % 0603 0.1 W)
R16  value 5.1k  [RESC0603(1608)_L]  (hidden comment: Resistor 120R +/-5 % 0603 0.1 W)
R17  value 10  [RESC0603(1608)_L]  (hidden comment: Resistor 120R +/-5 % 0603 0.1 W)
R19  value 10k  [RESC0603(1608)_L]  (hidden comment: Resistor 120R +/-5 % 0603 0.1 W)
R20  value 10k  [RESC0603(1608)_L]  (hidden comment: Resistor 120R +/-5 % 0603 0.1 W)
R21  value 2  [FP-CRCW2512-e3-MFG]  (hidden comment: CRCW251291R0JNEG)
R22  value 10  [RESC3116X70X50ML13T20]  (hidden comment: Resistor 0R +/- 0.05% 1206 250 mW)
R23  value 5.23k  [RESC0603(1608)_L]  (hidden comment: Resistor 120R +/-5 % 0603 0.1 W)
R24  value 30.1k  [RESC0603(1608)_L]  (hidden comment: Resistor 120R +/-5 % 0603 0.1 W)
R25  value 90k  [RESC0603(1608)_L]  (hidden comment: Resistor 120R +/-5 % 0603 0.1 W)
R26  value 10k  [RESC0603(1608)_L]  (hidden comment: Resistor 120R +/-5 % 0603 0.1 W)
R27  value 0.02  [RESC3116X70X50ML13T20]  (hidden comment: Resistor 1k +/-1% 1206 250 mW)
R28  value 499k  [RESC0603(1608)_L]  (hidden comment: Resistor 120R +/-5 % 0603 0.1 W)
R29  value 100k  [RESC0603(1608)_L]  (hidden comment: Resistor 120R +/-5 % 0603 0.1 W)
R32  value FUSE  [RESC0603(1608)_L]  (hidden comment: Resistor 120R +/-5 % 0603 0.1 W)
TP1  5003  [KSTN-5003]
TP2  5003  [KSTN-5003]
TP3  5003  [KSTN-5003]
TP4  5003  [KSTN-5003]
TP5  5003  [KSTN-5003]
TP6  5003  [KSTN-5003]
TP7  5003  [KSTN-5003]
TP8  5003  [KSTN-5003]
TP9  5003  [KSTN-5003]
TP10  5003  [KSTN-5003]
U3  BQ24650RVAT  [FP-RVA0016A-IPC_B]
U5  BQ28Z620DRZR_L  [VSON12_DRZ_TEX_L]
U7  LP5907MFX-3.3/NOPB  [FP-DBV0005A-IPC_B]
U8  L7805CDT-TR  [TO-252_L]

### Nets
3.3V: C35.1 R25.2 TP2.1 U7.4(OUT)
+5: C32.1 C34.1 TP1.1 U7.1(IN) U7.3(EN) U8.3(OUT)
Batt-: C13.2 C14.2 C15.1 C18.1 C20.1 C32.2 C33.2 C34.2 C35.2 C36.2 C37.2 C38.2 C39.2 C40.2 C42.2 C43.2 D1.2(A) D2.2(A) J4.2(NEG) J5.3 J5.4(MNT_1) J5.5(MNT_2) J6.2 J7.2 Q5.1(S1) Q6.2(Source) R5.1 R6.2 R7.2 R14.2 R24.1 R26.1 R29.1 TP3.1 TP4.1 TP7.1 TP10.1 U3.11(GND) U3.17(Thermal_Pad) U5.1(VSS) U5.13(PWPD) U7.2(GND) U8.4(GND)  [also labelled GND]
Solar+: D3.2(A) J6.1 R19.2 R20.2 R21.1 TP5.1
Batt+: C19.2 C21.1 C33.1 C42.1 C43.1 C44.1 C45.2 J4.1(POS) Q2.2(Source) Q3.2(Source) R12.1 R17.2 R27.2 R28.2 TP9.1 U3.9(SRN) U8.1(IN)  [also labelled MPPT_SRN]
Batt_Cell1: J5.2 R3.1 TP8.1
Batt_Cell2: J5.1 R4.1 R32.2 TP6.1
BMS_SCL: R9.2
BMS_SDA: R11.2
BMS_VC1: C15.2 C16.2 R3.2 U5.12(VC1)
BMS_VC2: C16.1 R4.2 U5.11(VC2)
BQ2_CHG: R16.2 U5.9(CHG)
BQ2_DSG: R15.2 U5.7(DSG)
BQ2_SCL: R8.1 U5.5(SCL)
BQ2_SDA: R10.1 U5.6(SDA)
BQ2_TS1: R5.2 U5.4(TS1)
MPPT_BTST: C41.1 D4.1(K) U3.16(BTST)
MPPT_CE: Q6.1(Gate)
MPPT_HIDRV: Q1.2(G1) U3.15(HIDRV)
MPPT_LODRV: Q5.2(G1) U3.13(LODRV)
MPPT_MPPSET: Q6.3(Drain) R25.1 R26.2 U3.2(MPPSET)
MPPT_PH: C41.2 L1.1 Q1.1(S1) Q5.7_8_9(D1) U3.14(PH)
MPPT_REGN: C40.1 D4.2(A) U3.12(REGN)
MPPT_SRP: C45.1 L1.2 R27.1 U3.10(SRP)
MPPT_STAT1: R19.1 U3.3(STAT1)
MPPT_STAT2: R20.1 U3.5(STAT2)
MPPT_TS: J7.1 R23.1 R24.2 U3.4(TS)
MPPT_VFB: C44.2 R28.1 R29.2 U3.8(VFB)
Solar_diode: C36.1 D3.1(K) Q1.7_8_9(D1) R22.1
NetC13_1: C13.1 C17.1 R6.1 U5.3(SRP)
NetC14_1: C14.1 C17.2 R7.1 U5.2(SRN)
NetC18_2: C18.2 U5.10(PBI)
NetC19_1: C19.1 C20.2
NetC21_2: C21.2 C22.1
NetC22_2: C22.2 Q4.2(Source) R13.1 R32.1
NetC37_1: C37.1 R22.2 U3.1(VCC)
NetC38_1: C38.1 R21.2
NetC39_1: C39.1 R23.2 U3.6(VREF) U3.7(TERM_EN)
NetD1_1: D1.1(K) R8.2 R9.1
NetD2_1: D2.1(K) R10.2 R11.1
NetQ2_1: Q2.1(Gate) R14.1
NetQ2_3: Q2.3(Drain) Q3.1(Gate) R12.2 R15.1
NetQ3_3: Q3.3(Drain) Q4.3(Drain)
NetQ4_1: Q4.1(Gate) R13.2 R16.1
NetR17_1: R17.1 U5.8(PACK)

Not connected (* = marked no-connect by the designer): U7 5(N/C)*

### Notes on the sheet
- MPPT System
- (near J7) Use 103AT- 2 thermistor
- (near Q6) Enable signal to atmega
- (near R32) Note this is a 0603 1A fuse OR a 0ohm jumper. Either way it is a 0603 pad
- Voltage Regulators
- 3V3 REG
- 5V REG
- Power Connectors
- BMS System
- DWG. NO.
- REV.
- SHT.
- THIS DOCUMENT AND THE DATA DISCLOSED HEREIN OR HEREWITH IS THE PROPERTY OF ALTIUM LIMITED AND MAY BE FREELY DISTRIBUTED IN WHOLE. NO RIGHTS ARE RESERVED OR EXPRESS OR IMPLIED WARANTEE GIVEN.
- REVISION
- DESCRIPTION
- DATE
- APPROVED
- ENG:
- APPROVALS
- PROJECT
- DSN:
- CHK:
- REFERENCE DOCUMENTS
- PROJECT REVISION:
- TITLE
- DOCUMENT REVISION:
- DESIGN ITEM:
- BOM:
- FAB DWG:
- PCB DWG:
- ASSY DWG:
- SCALE:
- SIZE
- B
- CAGE CODE
- FILE NAME
- DWG NO.
- SHEET
- OF
- REV

### Library data of the parts
C13-C22 C32-C35 C37 C39-C41 C44 C45 = CMP-001-00017-6: as C1 on sheet Mic; Tolerance: 10%; Mounting Technology: SM; Max Operating Temperature: 125°C; RoHS Compliant: True; Pins: 2; Case/Package: 0603; Min Operating Temperature: -55°C
C36 C38 C42 C43 = CMP-001-00084-1: Ceramic Capacitor, Multilayer, Ceramic, 250V, 10% +Tol, 10% -Tol, X7R, 15% TC, 0.1uF, Surface Mount, 1210; Min Operating Temperature: -55°C; Max Operating Temperature: 125°C; RoHS Compliant: Yes; Capacitor Type: Ceramic; Pins: 2; Mounting Technology: Surface Mount; Case/Package: 1210
D1 D2 = CMP-004-00031-1: Zener Diode, 5.6V V(Z), 5%, 0.2W, Silicon, Unidirectional; RoHS Compliant: Yes; Pins: 2; Max Operating Temperature: 150°C
D3 = CMP-004-00033-1: Rectifier Diode, Schottky, 1 Phase, 1 Element, 10A, 40V V(RRM), Silicon; Forward Voltage: 410mV; Pins: 3; RoHS Compliant: Yes; Min Operating Temperature: -65°C; Max Operating Temperature: 180°C
D4 = CMP-004-00032-1: Rectifier Diode, Schottky, 2 Element, 0.2A, 30V V(RRM), Silicon, TO-236AB; Forward Voltage: 1V; RoHS Compliant: Yes; Max Operating Temperature: 150°C; Pins: 3; Min Operating Temperature: -55°C
J4 = CMP-002-00073-1: Socket, DC supply, male, PIN: 2; MF: AMASS; Source: XT60PW-M.SchLib; Component Type: Standard; Pins: 2; Design Item ID: XT60PW-M; Case/Package: Package; Value: *; Check_prices: https://www.snapeda.com/parts/XT60PW-M/AMASS/view-part/?ref=eda; MP: XT60PW-M; SnapEDA_Link: https://www.snapeda.com/parts/XT60PW-M/AMASS/view-part/?ref=snap; Price: None; Availability: Not in stock
J5 = CMP-002-00074-1: Conn Shrouded Header HDR 3 POS 2.5mm Solder RA Side Entry SMD T/R
J6 = CMP-002-00076-1: Barrier Strip Terminal Block, 13.5A, 1.5mm2, 1 Row(s), 1 Deck(s); Voltage Rating: 400V; RoHS Compliant: Yes; Mounting Technology: Board
J7 = CMP-002-00077-1: Board Connector, 2 Contact(s), 1 Row(s), Male, Straight, 0.1 inch Pitch, Solder Terminal, Locking, Black Insulator; Connector Type: BOARD CONNECTOR; Max Operating Temperature: 105°C; Mounting Technology: Board; RoHS Compliant: Yes; Min Operating Temperature: -40°C
L1 = CMP-006-00021-1: General Purpose Inductor, 10uH, 20%, 1 Element, Composite-Core, SMD, 2525; Max Current Rating: 3A; Min Operating Temperature: -55°C; RoHS Compliant: Yes; Max Operating Temperature: 125°C; Pins: 2; Tolerance: 20%
Q1 Q5 = CMP-027-000000-1: Mosfet Array 2 N-Channel (Dual) 40V 20A 15.6W Surface Mount PowerPAKÂ® SO-8 Dual; MF: Vishay; SnapEDA_Link: https://www.snapeda.com/parts/SI7288DP-T1-GE3/Vishay+Siliconix/view-part/?ref=snap; Source: SI7288DP-T1-GE3.SchLib; Purchase-URL: https://pricing.snapeda.com/search/part/SI7288DP-T1-GE3/?ref=eda; Value: *; Check_prices: https://www.snapeda.com/parts/SI7288DP-T1-GE3/Vishay+Siliconix/view-part/?ref=eda; Pin Count: 6; Design Item ID: SI7288DP-T1-GE3; MP: SI7288DP-T1-GE3; Digi-Key_Part_Number: SI7288DP-T1-GE3TR-ND; Component Type: Standard; Package: SO-8 Vishay
Q2-Q4 Q6 = CMP-013-00035-1: Small Signal Field-Effect Transistor, 0.115A I(D), 60V, 1-Element, N-Channel, Silicon, Metal-oxide Semiconductor FET, TO-236AB; RoHS Compliant: No
R3 R4 R6-R17 R19 R20 R23-R26 R28 R29 R32 = CMP-009-00176-3: as R1 on sheet Mic; Max Operating Temperature: 155°C; Pins: 2; Case/Package: 0603; Min Operating Temperature: -55°C
R5 = CMP-009-00177-1: NTC Thermistor, 10000ohm, Through Hole Mount; Power: 10mW; Tolerance: 1%; Pins: 2; Mounting Technology: Through Hole; Min Operating Temperature: -50°C; Max Operating Temperature: 110°C; RoHS Compliant: Yes
R21 = CMP-009-00178-1: Fixed Resistor, Metal Glaze/thick Film, 1W, 91ohm, 500V, 5% +/-Tol, 200ppm/Cel, Surface Mount, 2512; Min Operating Temperature: -55°C; RoHS Compliant: Yes; Max Operating Temperature: 155°C; Tolerance: 5%; Power: 1W; Pins: 2; Mounting Technology: Surface Mount; Case/Package: 2512
R22 = CMP-009-00008-5: Chip Resistor, 0 Ohm, 0.25 W, -55 to 155 degC, 1206 (3216 Metric); Voltage Rating: 200V; Power: 250mW; Pins: 2; Min Operating Temperature: -55°C; Tolerance: 0.05%; RoHS Compliant: True; Max Operating Temperature: 155°C; Mounting Technology: SM; Case/Package: 1206
R27 = CMP-009-00011-5: Chip Resistor, 1 KOhm, +/- 1%, 0.25 W, -55 to 155 degC, 1206 (3216 Metric); Voltage Rating: 200V; Power: 250mW; Max Operating Temperature: 155°C; Mounting Technology: SM; Tolerance: 1%; Case/Package: 1206; RoHS Compliant: True; Min Operating Temperature: -55°C; Pins: 2
TP1-TP10 = CMP-002-00037-2: as TP11 on sheet Mic; Colour: Orange; Packaging: Bulk; Package Description: 1-Pin Through Hole Device, Dia 2.54 mm; Pins: 1; Package Reference: 5003; Datasheet Version: Jun-15; Case/Package: 5003; Mounting Technology: TH; Connector Type: TestPoint; Diameter: 2.54mm; Contact Material: Bronze; Datasheet URL: http://keyelco.com/userAssets/file/M65p56.pdf; Manufacturer URL: http://www.keyelco.com/; Package Quantity: 10; Contact Plating: Tin; RoHS Compliant: True
U3 = CMP-019-00049-1: Power Supply Support Circuit, Adjustable, 1 Channel, +3.85V, PQCC16; Max Supply Voltage: 28V; Min Supply Voltage: 5V; Max Operating Temperature: 85°C; RoHS Compliant: Yes; Pins: 16; Min Operating Temperature: -40°C; Case/Package: HVQCCN
U5 = CMP-00029-00001-1: No Description Available; Mfr_Name: Texas Instruments; RefDes: RefDes; Source: BQ28Z620DRZR.SchLib; Design Item ID: BQ28Z620DRZR_L; Type: DEV; Manufacturer_Part_Number: BQ28Z620DRZR; Copyright: Copyright (C) 2023 Ultra Librarian. All rights reserved.
U7 = CMP-019-00051-1: Fixed Positive LDO Regulator, 3.3V, 0.25V Dropout, PDSO5; Max Supply Voltage: 5.5V; Pins: 5; RoHS Compliant: Yes; Case/Package: LSSOP
U8 = CMP-019-00050-1: Fixed Positive Standard Regulator, 5VBIPolar, PSSO2; Max Supply Voltage: 25V; Pins: 2; RoHS Compliant: Yes

## Nets that join several sheets
3.3V: Mic (6 pins), LoRa (5 pins), ATMEGA (8 pins), Power (C35.1 R25.2 TP2.1 U7.4)
+5: Mic (D5.1 K1.A1), ATMEGA (16 pins), Power (6 pins)
Batt-: Mic (31 pins), LoRa (10 pins), ATMEGA (24 pins), Power (43 pins)
ATMEGA_wakeup_3v3: LoRa (J1.6 U6.14), ATMEGA (TP22.1 U9.9)
BMS_SCL: ATMEGA (TP37.1 U2.6), Power (R9.2)
BMS_SDA: ATMEGA (TP38.1 U2.5), Power (R11.2)
LoRa_MISO: LoRa (U6.2), ATMEGA (TP35.1 U9.6)
LoRa_MOSI: LoRa (U6.3), ATMEGA (TP34.1 U9.5)
LoRa_NSS: LoRa (U6.5), ATMEGA (TP32.1 U9.3)
LoRa_RST: LoRa (U6.6), ATMEGA (TP42.1 U2.9)
LoRa_SCK: LoRa (U6.4), ATMEGA (TP33.1 U9.4)
MIC_power_off: Mic (R33.1), ATMEGA (U1.13)
MPPT_CE: ATMEGA (TP36.1 U2.4), Power (Q6.1)
MPPT_STAT1: ATMEGA (TP43.1 U9.7), Power (R19.1 U3.3)
MPPT_STAT2: ATMEGA (TP44.1 U9.8), Power (R20.1 U3.5)